# EAGLE design Mini Robot PCB (EAGLE 9.6.2)
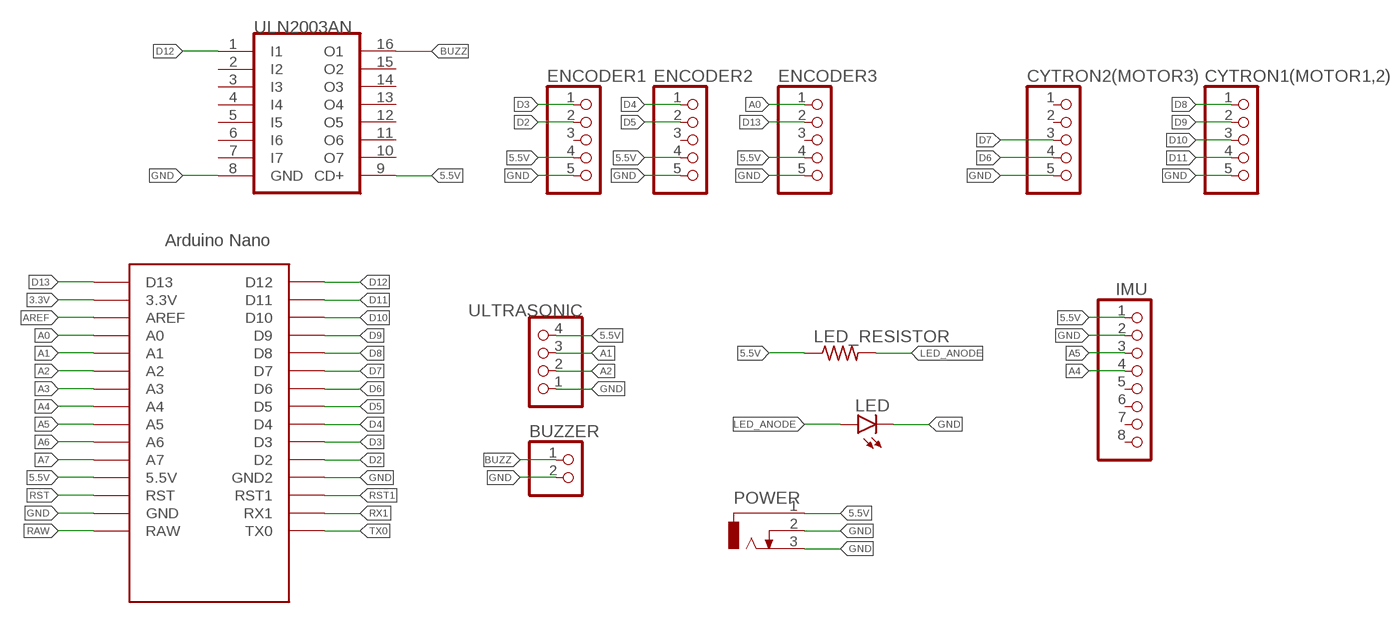
[diagram p0: schematic, sheet 1]

## Parts
BUZZER  PINHD-1X2  [1X02]
CYTRON1(MOTOR1,2)  PINHD-1X5  [1X05]
CYTRON2(MOTOR3)  PINHD-1X5  [1X05]
ENCODER1  PINHD-1X5  [1X05]
ENCODER2  PINHD-1X5  [1X05]
ENCODER3  PINHD-1X5  [1X05]
IC1  ULN2003AN  [DIL16]
IMU  PINHD-1X8  [1X08]
LED  LED5MM  [LED5MM]
LED_RESISTOR  RES-10  [0207/10]
POWER  CON_JACK  [DCJ0303]
U$1  ARDUINO_NANO  [NANO]
ULTRASONIC  PINHD-1X4  [1X04]

## Nets
3.3V: U$1.3.3V
5.5V: ENCODER1.4 ENCODER2.4 ENCODER3.4 IC1.9(CD+) IMU.1 LED_RESISTOR.1 POWER.1 U$1.5V(5.5V) ULTRASONIC.4
A0: ENCODER3.1 U$1.A0
A1: U$1.A1 ULTRASONIC.3
A2: U$1.A2 ULTRASONIC.2
A3: U$1.A3
A4: IMU.4 U$1.A4
A5: IMU.3 U$1.A5
A6: U$1.A6
A7: U$1.A7
AREF: U$1.AREF
BUZZ: BUZZER.1 IC1.16(O1)
D2: ENCODER1.2 U$1.D2
D3: ENCODER1.1 U$1.D3
D4: ENCODER2.1 U$1.D4
D5: ENCODER2.2 U$1.D5
D6: CYTRON2(MOTOR3).4 U$1.D6
D7: CYTRON2(MOTOR3).3 U$1.D7
D8: CYTRON1(MOTOR1,2).1 U$1.D8
D9: CYTRON1(MOTOR1,2).2 U$1.D9
D10: CYTRON1(MOTOR1,2).3 U$1.D10
D11: CYTRON1(MOTOR1,2).4 U$1.D11
D12: IC1.1(I1) U$1.D12
D13: ENCODER3.2 U$1.D13
GND: BUZZER.2 CYTRON1(MOTOR1,2).5 CYTRON2(MOTOR3).5 ENCODER1.5 ENCODER2.5 ENCODER3.5 IC1.8(GND) IMU.2 LED.K(C) POWER.2 POWER.3 U$1.GND U$1.GND1(GND2) ULTRASONIC.1
LED_ANODE: LED.A LED_RESISTOR.2
RAW: U$1.RAW
RST: U$1.RST
RST1: U$1.RST1
RX1: U$1.RX1
TX0: U$1.TX0
Unconnected: CYTRON2(MOTOR3).1 CYTRON2(MOTOR3).2 ENCODER1.3 ENCODER2.3 ENCODER3.3 IC1.2(I2) IC1.3(I3) IC1.4(I4) IC1.5(I5) IC1.6(I6) IC1.7(I7) IC1.10(O7) IC1.11(O6) IC1.12(O5) IC1.13(O4) IC1.14(O3) IC1.15(O2) IMU.5 IMU.6 IMU.7 IMU.8

## Library data of the parts
BUZZER = MIA-Training:PINHD-1X2: PIN HEADER
CYTRON1(MOTOR1,2) CYTRON2(MOTOR3) ENCODER1-ENCODER3 = MIA-Training:PINHD-1X5: PIN HEADER
IC1 = MIA-Training:ULN2003A: DRIVER ARRAY
IMU = MIA-Training:PINHD-1X8: PIN HEADER
LED = led:LED: LED OSRAM: - CHIPLED LG R971, LG N971, LY N971, LG Q971, LY Q971, LO R971, LY R971 LH N974, LH R974 LS Q976, LO Q976, LY Q976 LO Q996 - Hyper CHIPLED LW Q18S LB Q993, LB Q99A, LB R99A - SideLED LS A670, LO A670, LY A670, LG A670, LP A670 LB A673, LV A673, LT A673, LW A673 LH A674 LY A675 LS A676, LA A676, LO A676, LY A676, LW A676 LS A679, LY A679, LG A679 - Hyper Micro SIDELED® LS Y876, LA Y876, LO Y876, LY Y876 LT Y87S - SmartLED LW L88C, LW L88S LB L89C, LB L89S, LG L890 LS L89K, LO L89K, LY L89K LS L896, LA L896, LO L896, LY L896 - TOPLED LS T670, LO T670, LY T670, LG T670, LP T670 LSG T670, LSP T670, LSY T670, LOP T670, LYG T670 LG T671, LOG T671, LSG T671 LB T673, LV T673, LT T673, LW T673 LH T674 LS T676, LA T676, LO T676, LY T676, LB T676, LH T676, LSB T676, LW T676 LB T67C, LV T67C, LT T67C, LS T67K, LO T67K, LY T67K, LW E67C LS E67B, LA E67B, LO E67B, LY E67B, LB E67C, LV E67C, LT E67C LW T67C LS T679, LY T679, LG T679 LS T770, LO T770, LY T770, LG T770, LP T770 LB T773, LV T773, LT T773, LW T773 LH T774 LS E675, LA E675, LY E675, LS T675 LS T776, LA T776, LO T776, LY T776, LB T776 LHGB T686 LT T68C, LB T68C - Hyper Mini TOPLED® LB M676 - Mini TOPLED Santana® LG M470 LS M47K, LO M47K, LY M47K Source: http://www.osram.convergy.de LUXEON: - LUMILED® LXK2-PW12-R00, LXK2-PW12-S00, LXK2-PW14-U00, LXK2-PW14-V00 LXK2-PM12-R00, LXK2-PM12-S00, LXK2-PM14-U00 LXK2-PE12-Q00, LXK2-PE12-R00, LXK2-PE12-S00, LXK2-PE14-T00, LXK2-PE14-U00 LXK2-PB12-K00, LXK2-PB12-L00, LXK2-PB12-M00, LXK2-PB14-N00, LXK2-PB14-P00, LXK2-PB14-Q00 LXK2-PR12-L00, LXK2-PR12-M00, LXK2-PR14-Q00, LXK2-PR14-R00 LXK2-PD12-Q00, LXK2-PD12-R00, LXK2-PD12-S00 LXK2-PH12-R00, LXK2-PH12-S00 LXK2-PL12-P00, LXK2-PL12-Q00, LXK2-PL12-R00 Source: www.luxeon.com KINGBRIGHT: KA-3528ASYC Source: www.kingbright.com
LED_RESISTOR = MIA-Training:RES-10
POWER = MIA-Training:CON_JACK: DC POWER JACK Source: DCJ0303.pdf; OC_FARNELL: unknown; OC_NEWARK: unknown
U$1 = MIA-Training:ARDUINO_NANO: Arduino Nano
ULTRASONIC = MIA-Training:PINHD-1X4: PIN HEADER

## Board
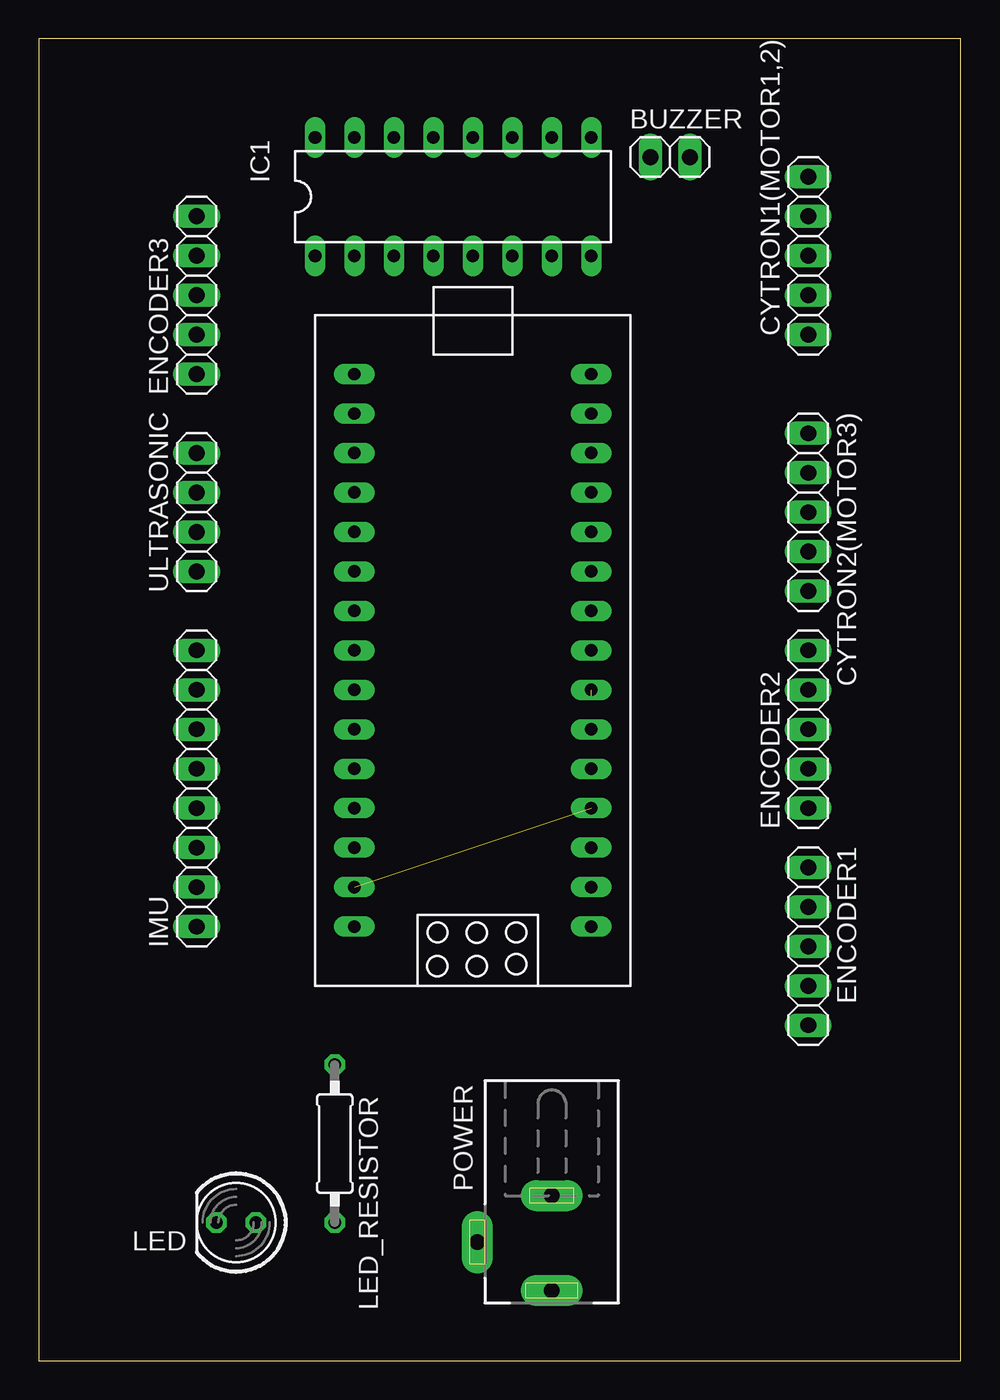
[diagram p1: board, top side]
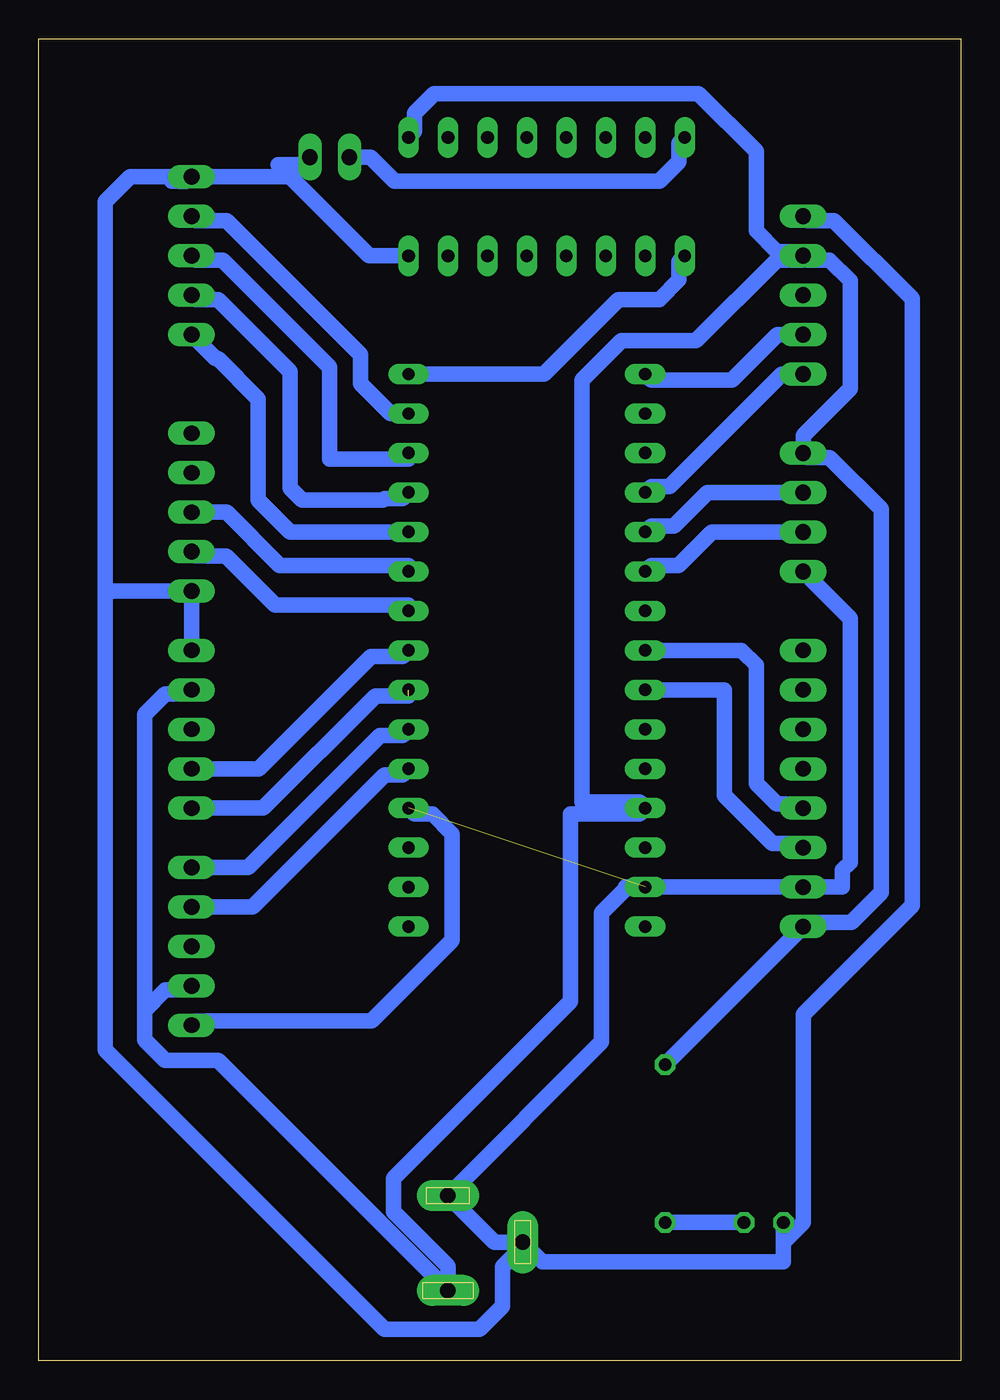
[diagram p2: board, bottom side, seen from below]

Size 59.36 x 85.08 mm. Coordinates in mm from the lower left corner, seen from the top.
Outline: 0,0 59.36,0 59.36,85.08 0,85.08 0,0
Copper layers (1*16): Top 0.035mm / dielectric 1.5mm / Bottom 0.035mm
Design rules "default *": minimum track width 6mil, minimum drill 0.35mm, track to track 1mm, track to pad 1mm, pad to pad 6mil, via to via 6mil, smd to smd 6mil, copper to edge 40mil, drill to drill 6mil, minimum pad ring 10mil, minimum via ring 8mil, stop-mask expansion 4mil, vias tented up to drill 0mil, thermal gap 10mil

### Footprints (pad centres in the part's own frame; a part is rotated, then mirrored left to right if it is on the bottom)
1X02 = drill 1.016 long: 1 -1.27,0; 2 1.27,0
1X05 = drill 1.016 long: 1 -5.08,0; 2 -2.54,0; 3 0,0; 4 2.54,0; 5 5.08,0
DIL16 = drill 0.813 long: 1 -8.89,-3.81; 2 -6.35,-3.81; 3 -3.81,-3.81; 4 -1.27,-3.81; 5 1.27,-3.81; 6 3.81,-3.81; 7 6.35,-3.81; 8 8.89,-3.81; 9 8.89,3.81; 10 6.35,3.81; 11 3.81,3.81; 12 1.27,3.81; 13 -1.27,3.81; 14 -3.81,3.81; 15 -6.35,3.81; 16 -8.89,3.81
1X08 = drill 1.016 long: 1 -8.89,0; 2 -6.35,0; 3 -3.81,0; 4 -1.27,0; 5 1.27,0; 6 3.81,0; 7 6.35,0; 8 8.89,0
LED5MM = drill 0.813 octagon: A -1.27,0; K 1.27,0
0207/10 = drill 0.813 octagon: 1 -5.08,0; 2 5.08,0
DCJ0303 = drill 1 pad 2 long: 1 0,3.1; 2 4.8,0; 3 0,-3
NANO = drill 0.8 long: 3.3V -10.16,24.13; 5V -10.16,-1.27; A0 -10.16,19.05; A1 -10.16,16.51; A2 -10.16,13.97; A3 -10.16,11.43; A4 -10.16,8.89; A5 -10.16,6.35; A6 -10.16,3.81; A7 -10.16,1.27; AREF -10.16,21.59; D2 5.08,1.27; D3 5.08,3.81; D4 5.08,6.35; D5 5.08,8.89; D6 5.08,11.43; D7 5.08,13.97; D8 5.08,16.51; D9 5.08,19.05; D10 5.08,21.59; D11 5.08,24.13; D12 5.08,26.67; D13 -10.16,26.67; GND -10.16,-6.35; GND1 5.08,-1.27; RAW -10.16,-8.89; RST -10.16,-3.81; RST1 5.08,-3.81; RX1 5.08,-6.35; TX0 5.08,-8.89
1X04 = drill 1.016 long: 1 -3.81,0; 2 -1.27,0; 3 1.27,0; 4 3.81,0

### Placement (x,y rotation side)
BUZZER  40.64,77.47 0 top
CYTRON1(MOTOR1,2)  49.53,71.12 90 top
CYTRON2(MOTOR3)  49.53,54.61 270 top
ENCODER1  49.53,26.67 270 top
ENCODER2  49.53,40.64 90 top
ENCODER3  10.16,68.58 90 top
IC1  26.67,74.93 0 top
IMU  10.16,36.83 90 top
LED  12.7,8.89 180 top
LED_RESISTOR  19.05,13.97 270 top
POWER  33.02,7.62 180 top
U$1  30.48,36.83 0 top
ULTRASONIC  10.16,54.61 90 top

### Tracks (layer width: path | path; a pad name or v marks a point on that pad's centre or on a via)
5.5V
  Bottom 1: LED_RESISTOR.1 IMU.1 9.88,28.22 7.05,28.22 5.14,30.14 5.14,54.82 8.46,58.14 9.88,58.14 ULTRASONIC.4 10.16,59.54 7.14,62.56 7.14,69.52 8.46,70.84 9.88,70.84 ENCODER3.4 10.16,70.84 | 10.16,70.84 11.86,70.84 17.05,65.65 21.87,65.65 24.4,63.12 24.4,35.95 20.71,35.95 U$1.5V 20.71,35.17 25.13,35.17 25.13,23.13 36.52,11.74 36.52,9.58 33.02,6.08 POWER.1 47.83,19.33 51.23,19.33 52.55,20.65 52.55,22.53 | 10.16,70.84 10.7,71.38 11.84,71.38 13.18,72.72 13.18,77.86 16.89,81.56 33.91,81.56 35.18,80.3 35.18,79.12 IC1.9 | ENCODER1.4 49.79,23.87 51.21,23.87 52.55,22.53 | ENCODER2.4 49.81,42.9 51.23,42.9 52.55,41.58 52.55,22.53
A0
  Bottom 1: U$1.A0 19.93,56.27 18.77,56.27 11.54,63.5 ENCODER3.1
A1
  Bottom 1: ULTRASONIC.3 16.33,55.88 18.49,53.73 19.93,53.73 U$1.A1
A2
  Bottom 1: ULTRASONIC.2 16.04,53.34 18.2,51.19 19.93,51.19 U$1.A2
A4
  Bottom 1: IMU.4 10.44,35.84 11.86,35.84 13.18,37.16 13.18,44.78 14.12,45.72 U$1.A4
A5
  Bottom 1: IMU.3 10.44,33.3 12.15,33.3 15.24,36.39 15.24,43.18 U$1.A5
BUZZ
  Bottom 1: IC1.16 18.16,78.36 18.16,77.19 19.43,75.92 36.45,75.92 38.01,77.47 BUZZER.1
D2
  Bottom 1: U$1.D2 35.95,37.71 37.11,37.71 45.61,29.21 ENCODER1.2
D3
  Bottom 1: ENCODER1.1 45.9,31.75 37.39,40.25 35.95,40.25 U$1.D3
D4  (1 unrouted)
  Bottom 1: ENCODER2.1 44.92,35.56 37.68,42.79 35.56,42.79
D5
  Bottom 1: ENCODER2.2 45.21,38.1 37.97,45.33 35.95,45.33 U$1.D5
D6
  Bottom 1: CYTRON2(MOTOR3).4 49.25,51.79 47.29,51.79 44.14,48.65 35.56,48.65 U$1.D6
D7
  Bottom 1: CYTRON2(MOTOR3).3 47.28,54.61 43.85,51.19 35.56,51.19 U$1.D7
D8
  Bottom 1: CYTRON1(MOTOR1,2).1 47.98,64.49 47.83,64.49 45.24,61.9 45.24,55.4 43.18,53.34 U$1.D8
D9
  Bottom 1: CYTRON1(MOTOR1,2).2 49.25,68.3 47.83,68.3 43.18,63.65 43.18,56.17 42.4,55.39 37.21,55.39 37.11,55.49 35.95,55.49 U$1.D9
D10
  Bottom 0.152: U$1.D10 35.95,58.08 35.95,58.03
  Bottom 1: CYTRON1(MOTOR1,2).3 49.25,70.84 47.54,70.84 40.64,63.94 40.64,58.03 35.95,58.03 35.56,58.03
D11
  Bottom 1: CYTRON1(MOTOR1,2).4 49.25,73.38 47.25,73.38 38.64,64.77 38.64,62.88 36.72,60.96 U$1.D11
D12
  Bottom 1: IC1.1 18.16,70.74 18.16,69.56 19.43,68.3 22.05,68.3 26.85,63.5 U$1.D12
D13
  Bottom 1: ENCODER3.2 11.83,66.04 14.75,63.11 19.93,63.11 U$1.D13
GND  (1 unrouted)
  Bottom 0.152: ENCODER1.5 49.78,21.54
  Bottom 1: 55.09,49.2 55.09,19.99 37.12,2.02 30.98,2.02 29.52,3.48 29.52,6.04 27.94,7.62 POWER.2 | POWER.2 30.02,7.62 POWER.3 23.13,20.51 23.13,28.83 21.59,30.37 21.59,30.48 U$1.GND IMU.2 7.62,30.48 7.62,31.6 7.14,32.08 7.14,47.78 ULTRASONIC.1 | CYTRON1(MOTOR1,2).5 53.49,76.2 55.09,74.6 55.09,49.2 | POWER.2 26.95,6.35 11.43,6.35 11.43,7.62 | 11.43,7.62 LED.K | ENCODER3.5 9.88,73.38 8.17,73.38 3.14,68.34 3.14,29.31 10.16,22.28 10.16,8.89 11.43,7.62 | CYTRON1(MOTOR1,2).5 43.18,76.2 BUZZER.2 41.63,77.19 41.63,76.99 43.97,76.99 38.1,71.12 IC1.8 | 50.8,76.2 CYTRON1(MOTOR1,2).5 | CYTRON1(MOTOR1,2).5 49.81,75.92 50.8,75.92 50.52,76.2 CYTRON1(MOTOR1,2).5 | 55.09,49.2 54.76,49.53 CYTRON2(MOTOR3).5 ENCODER2.5 | ENCODER1.5 49.25,21.87 37.93,21.87 32.75,27.05 32.75,33.91 34.01,35.17 35.17,35.17 U$1.GND1
LED_ANODE
  Bottom 1: LED_RESISTOR.2 LED.A